# Altium project 电机驱动.PrjPcb
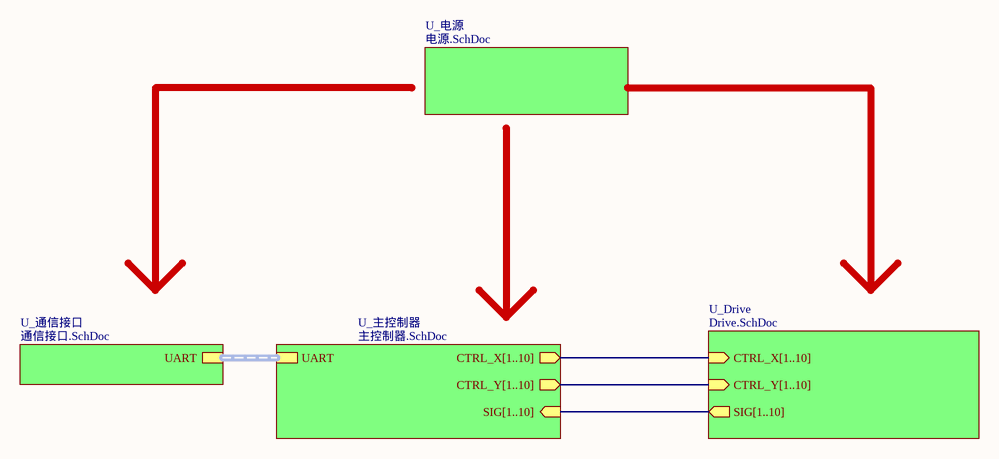
[diagram p0: 顶层设计.SchDoc]
8 sheets, 219 parts. Net scope: hierarchical (ports join the sheet entries above them; power ports are global).
Board file: 货道电机驱动板.PcbDoc
Sheets:
  顶层设计.SchDoc
    U_Drive = Drive.SchDoc
      U_Drive_Y1 = Drive_Y.SchDoc
      U_Drive_Y2 = Drive_Y.SchDoc
      U_Drive_Y3 = Drive_Y.SchDoc
      U_Drive_Y4 = Drive_Y.SchDoc
      U_Drive_Y5 = Drive_Y.SchDoc
      U_Drive_Y6 = Drive_Y.SchDoc
      U_Drive_Y7 = Drive_Y.SchDoc
      U_Drive_Y8 = Drive_Y.SchDoc
      U_Drive_Y9 = Drive_Y.SchDoc
      U_Drive_Y10 = Drive_Y.SchDoc
      U_Drive_X1 = Drive_X.SchDoc
      U_Drive_X2 = Drive_X.SchDoc
      U_Drive_X3 = Drive_X.SchDoc
      U_Drive_X4 = Drive_X.SchDoc
      U_Drive_X5 = Drive_X.SchDoc
      U_Drive_X6 = Drive_X.SchDoc
      U_Drive_X7 = Drive_X.SchDoc
      U_Drive_X8 = Drive_X.SchDoc
      U_Drive_X9 = Drive_X.SchDoc
      U_Drive_X10 = Drive_X.SchDoc
      U_SIG_IN1 = SIG_IN.SchDoc
      U_SIG_IN2 = SIG_IN.SchDoc
      U_SIG_IN3 = SIG_IN.SchDoc
      U_SIG_IN4 = SIG_IN.SchDoc
      U_SIG_IN5 = SIG_IN.SchDoc
      U_SIG_IN6 = SIG_IN.SchDoc
      U_SIG_IN7 = SIG_IN.SchDoc
      U_SIG_IN8 = SIG_IN.SchDoc
      U_SIG_IN9 = SIG_IN.SchDoc
      U_SIG_IN10 = SIG_IN.SchDoc
    U_电源 = 电源.SchDoc
    U_主控制器 = 主控制器.SchDoc
    U_通信接口 = 通信接口.SchDoc

## Sheet 顶层设计.SchDoc
size A4; Organization: Altium Limited; Address1: L3, 12a Rodborough Rd; Address2: Frenchs Forest; Address3: NSW; Address4: Australia 2086

### Sub-sheets
U_Drive = Drive.SchDoc: CTRL_Y[1..10] (in), SIG[1..10] (out), CTRL_X[1..10] (in)
U_主控制器 = 主控制器.SchDoc: CTRL_X[1..10] (out), CTRL_Y[1..10] (out), SIG[1..10] (in), UART (harness USART)
U_电源 = 电源.SchDoc: no entries
U_通信接口 = 通信接口.SchDoc: UART (harness USART)

### Buses and harness runs
bus sheet U_Drive/CTRL_X[1..10] = sheet U_主控制器/CTRL_X[1..10]
bus sheet U_Drive/CTRL_Y[1..10] = sheet U_主控制器/CTRL_Y[1..10]
bus sheet U_Drive/SIG[1..10] = sheet U_主控制器/SIG[1..10]
harness sheet U_主控制器/UART = sheet U_通信接口/UART

### Notes on the sheet
- Title
- Size:
- Date:
- A4
- Number:
- Time:
- Revision:
- Sheet
- of
- File:

## Sheet Drive.SchDoc
size A4; Organization: Altium Limited; Address1: L3, 12a Rodborough Rd; Address2: Frenchs Forest; Address3: NSW; Address4: Australia 2086
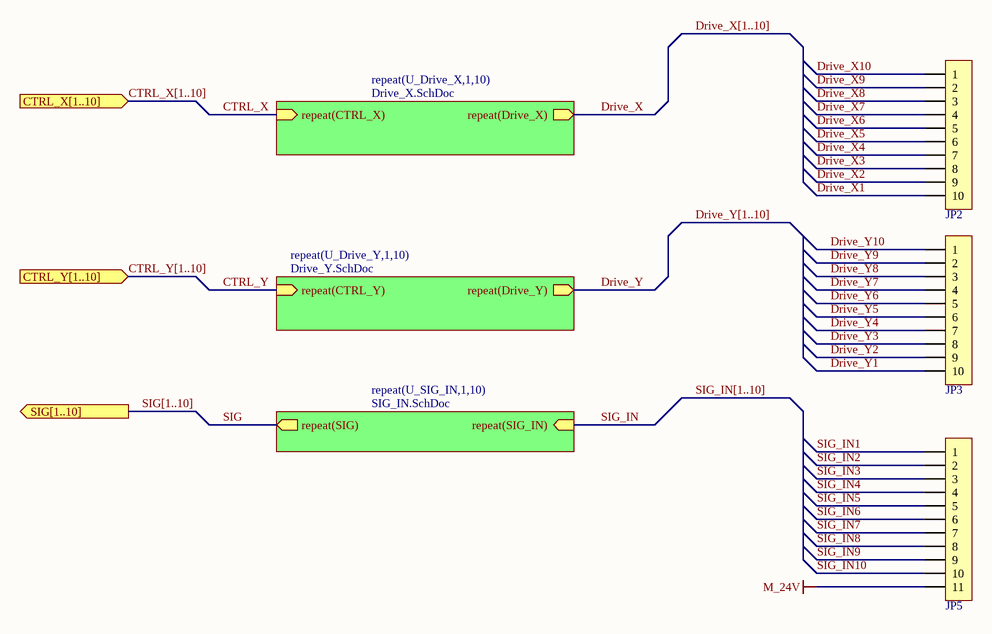
[diagram p1: Drive.SchDoc]

### Parts
JP2  XH2.54-10P  [XH2.54-10P]  (value not drawn)
JP3  XH2.54-10P  [XH2.54-10P]  (value not drawn)
JP5  XH2.54-11P  [XH2.54-11P]  (value not drawn)

### Sub-sheets
repeat(U_Drive_X,1,10) = Drive_X.SchDoc: repeat(CTRL_X) (in), repeat(Drive_X) (out)
repeat(U_Drive_Y,1,10) = Drive_Y.SchDoc: repeat(CTRL_Y) (in), repeat(Drive_Y) (out)
repeat(U_SIG_IN,1,10) = SIG_IN.SchDoc: repeat(SIG) (out), repeat(SIG_IN) (in)

### Ports
CTRL_X[1..10] (in), CTRL_Y[1..10] (in), SIG[1..10] (out)

### Nets
M_24V: JP5.11
CTRL_X: sheet repeat(U_Drive_X,1,10)/repeat(CTRL_X)
CTRL_Y: sheet repeat(U_Drive_Y,1,10)/repeat(CTRL_Y)
Drive_X: sheet repeat(U_Drive_X,1,10)/repeat(Drive_X)
Drive_X1: JP2.10  [project net Drive_X]
Drive_X2: JP2.9  [project net Drive_X]
Drive_X3: JP2.8  [project net Drive_X]
Drive_X4: JP2.7  [project net Drive_X]
Drive_X5: JP2.6  [project net Drive_X]
Drive_X6: JP2.5  [project net Drive_X]
Drive_X7: JP2.4  [project net Drive_X]
Drive_X8: JP2.3  [project net Drive_X]
Drive_X9: JP2.2  [project net Drive_X]
Drive_X10: JP2.1  [project net Drive_X]
Drive_Y: sheet repeat(U_Drive_Y,1,10)/repeat(Drive_Y)
Drive_Y1: JP3.10  [project net Drive_Y]
Drive_Y2: JP3.9  [project net Drive_Y]
Drive_Y3: JP3.8  [project net Drive_Y]
Drive_Y4: JP3.7  [project net Drive_Y]
Drive_Y5: JP3.6  [project net Drive_Y]
Drive_Y6: JP3.5  [project net Drive_Y]
Drive_Y7: JP3.4  [project net Drive_Y]
Drive_Y8: JP3.3  [project net Drive_Y]
Drive_Y9: JP3.2  [project net Drive_Y]
Drive_Y10: JP3.1  [project net Drive_Y]
SIG: sheet repeat(U_SIG_IN,1,10)/repeat(SIG)
SIG_IN: sheet repeat(U_SIG_IN,1,10)/repeat(SIG_IN)
SIG_IN1: JP5.1  [project net SIG_IN]
SIG_IN2: JP5.2  [project net SIG_IN]
SIG_IN3: JP5.3  [project net SIG_IN]
SIG_IN4: JP5.4  [project net SIG_IN]
SIG_IN5: JP5.5  [project net SIG_IN]
SIG_IN6: JP5.6  [project net SIG_IN]
SIG_IN7: JP5.7  [project net SIG_IN]
SIG_IN8: JP5.8  [project net SIG_IN]
SIG_IN9: JP5.9  [project net SIG_IN]
SIG_IN10: JP5.10  [project net SIG_IN]

### Buses and harness runs
bus CTRL_X[1..10] = port CTRL_X[1..10]
bus CTRL_Y[1..10] = port CTRL_Y[1..10]
bus Drive_X[1..10]
bus Drive_Y[1..10]
bus SIG[1..10] = port SIG[1..10]
bus SIG_IN[1..10]

### Notes on the sheet
- Title
- Size:
- Date:
- A4
- Number:
- Time:
- Revision:
- Sheet
- of
- File:

### Library data of the parts
JP2 JP3 = Header 10: 10P接插件; 版权归属: 源创客; BOM名称: 10P接插件; 学习资源: www.ooocke.com
JP5 = Header 11: 11P接插件; 版权归属: 源创客; BOM名称: 11P接插件; 学习资源: www.ooocke.com

## Sheet Drive_Y.SchDoc
size A4; Organization: Altium Limited; Address1: L3, 12a Rodborough Rd; Address2: Frenchs Forest; Address3: NSW; Address4: Australia 2086
Used 10 times, as channels U_Drive/U_Drive_Y1, U_Drive/U_Drive_Y2, U_Drive/U_Drive_Y3, U_Drive/U_Drive_Y4, U_Drive/U_Drive_Y5, U_Drive/U_Drive_Y6, U_Drive/U_Drive_Y7, U_Drive/U_Drive_Y8, U_Drive/U_Drive_Y9, U_Drive/U_Drive_Y10. Parts and nets are listed once, with the designators drawn on the sheet.
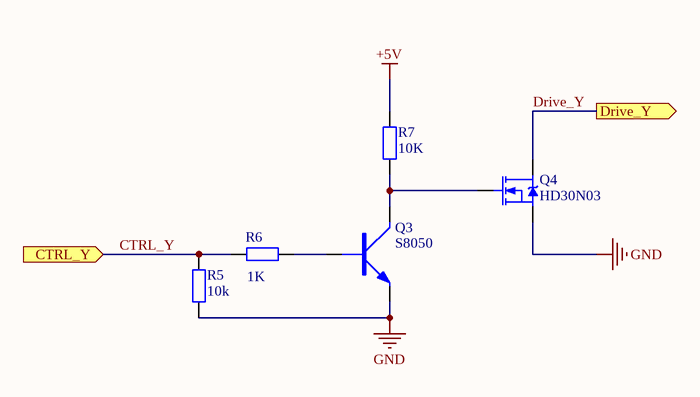
[diagram p2: Drive_Y.SchDoc]

### Parts
Q3  S8050  [SOT-23]
Q4  HD30N03  [TO252]
R5  10k  [R 0603]
R6  1K  [R 0603]
R7  10K  [R 0603]

### Ports
CTRL_Y (in), Drive_Y (out)

### Nets
+5V: R7.2
GND: Q3.E Q4.S R5.1
CTRL_Y: R5.2 R6.1 ; port CTRL_Y
Drive_Y: Q4.D ; port Drive_Y
NetQ3_B: Q3.B R6.2
NetQ3_C: Q3.C Q4.G R7.1

### Channels
U_Drive/U_Drive_Y1: designators end in _U_Drive_Y1; ports CTRL_Y=CTRL_Y Drive_Y=Drive_Y
U_Drive/U_Drive_Y2: designators end in _U_Drive_Y2; ports CTRL_Y=CTRL_Y Drive_Y=Drive_Y
U_Drive/U_Drive_Y3: designators end in _U_Drive_Y3; ports CTRL_Y=CTRL_Y Drive_Y=Drive_Y
U_Drive/U_Drive_Y4: designators end in _U_Drive_Y4; ports CTRL_Y=CTRL_Y Drive_Y=Drive_Y
U_Drive/U_Drive_Y5: designators end in _U_Drive_Y5; ports CTRL_Y=CTRL_Y Drive_Y=Drive_Y
U_Drive/U_Drive_Y6: designators end in _U_Drive_Y6; ports CTRL_Y=CTRL_Y Drive_Y=Drive_Y
U_Drive/U_Drive_Y7: designators end in _U_Drive_Y7; ports CTRL_Y=CTRL_Y Drive_Y=Drive_Y
U_Drive/U_Drive_Y8: designators end in _U_Drive_Y8; ports CTRL_Y=CTRL_Y Drive_Y=Drive_Y
U_Drive/U_Drive_Y9: designators end in _U_Drive_Y9; ports CTRL_Y=CTRL_Y Drive_Y=Drive_Y
U_Drive/U_Drive_Y10: designators end in _U_Drive_Y10; ports CTRL_Y=CTRL_Y Drive_Y=Drive_Y

### Notes on the sheet
- Title
- Size:
- Date:
- A4
- Number:
- Time:
- Revision:
- Sheet
- of
- File:

### Library data of the parts
Q3 = NPN: NPN三极管
Q4 = N-MOS: N沟道场效应管
R5-R7 = R: 贴片电阻; 版权归属: 源创客; BOM名称: 贴片电阻; 学习资源: www.ooocke.com

## Sheet Drive_X.SchDoc
size A4; Organization: Altium Limited; Address1: L3, 12a Rodborough Rd; Address2: Frenchs Forest; Address3: NSW; Address4: Australia 2086
Used 10 times, as channels U_Drive/U_Drive_X1, U_Drive/U_Drive_X2, U_Drive/U_Drive_X3, U_Drive/U_Drive_X4, U_Drive/U_Drive_X5, U_Drive/U_Drive_X6, U_Drive/U_Drive_X7, U_Drive/U_Drive_X8, U_Drive/U_Drive_X9, U_Drive/U_Drive_X10. Parts and nets are listed once, with the designators drawn on the sheet.
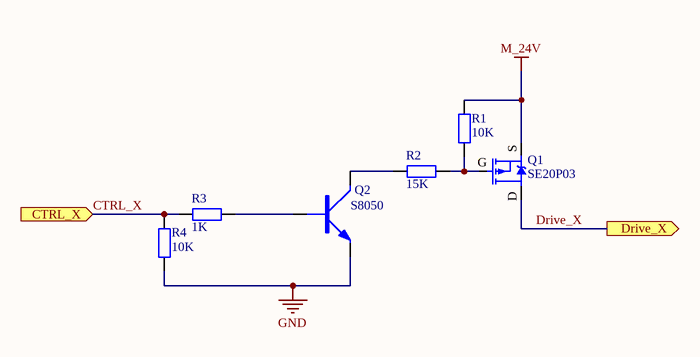
[diagram p3: Drive_X.SchDoc]

### Parts
Q1  SE20P03  [TO252]
Q2  S8050  [SOT-23]
R1  10K  [R 0603]
R2  15K  [R 0603]
R3  1K  [R 0603]
R4  10K  [R 0603]

### Ports
CTRL_X (in), Drive_X (out)

### Nets
GND: Q2.E R4.2
M_24V: Q1.S R1.2
CTRL_X: R3.1 R4.1 ; port CTRL_X
Drive_X: Q1.D ; port Drive_X
NetQ1_G: Q1.G R1.1 R2.1
NetQ2_B: Q2.B R3.2
NetQ2_C: Q2.C R2.2

### Channels
U_Drive/U_Drive_X1: designators end in _U_Drive_X1; ports CTRL_X=CTRL_X Drive_X=Drive_X
U_Drive/U_Drive_X2: designators end in _U_Drive_X2; ports CTRL_X=CTRL_X Drive_X=Drive_X
U_Drive/U_Drive_X3: designators end in _U_Drive_X3; ports CTRL_X=CTRL_X Drive_X=Drive_X
U_Drive/U_Drive_X4: designators end in _U_Drive_X4; ports CTRL_X=CTRL_X Drive_X=Drive_X
U_Drive/U_Drive_X5: designators end in _U_Drive_X5; ports CTRL_X=CTRL_X Drive_X=Drive_X
U_Drive/U_Drive_X6: designators end in _U_Drive_X6; ports CTRL_X=CTRL_X Drive_X=Drive_X
U_Drive/U_Drive_X7: designators end in _U_Drive_X7; ports CTRL_X=CTRL_X Drive_X=Drive_X
U_Drive/U_Drive_X8: designators end in _U_Drive_X8; ports CTRL_X=CTRL_X Drive_X=Drive_X
U_Drive/U_Drive_X9: designators end in _U_Drive_X9; ports CTRL_X=CTRL_X Drive_X=Drive_X
U_Drive/U_Drive_X10: designators end in _U_Drive_X10; ports CTRL_X=CTRL_X Drive_X=Drive_X

### Notes on the sheet
- Title
- Size:
- Date:
- A4
- Number:
- Time:
- Revision:
- Sheet
- of
- File:

### Library data of the parts
Q1 = P-MOS: P沟道场效应管
Q2 = NPN: NPN三极管
R1-R4 = R: 贴片电阻; 版权归属: 源创客; BOM名称: 贴片电阻; 学习资源: www.ooocke.com

## Sheet SIG_IN.SchDoc
size A4; Organization: Altium Limited; Address1: L3, 12a Rodborough Rd; Address2: Frenchs Forest; Address3: NSW; Address4: Australia 2086
Used 10 times, as channels U_Drive/U_SIG_IN1, U_Drive/U_SIG_IN2, U_Drive/U_SIG_IN3, U_Drive/U_SIG_IN4, U_Drive/U_SIG_IN5, U_Drive/U_SIG_IN6, U_Drive/U_SIG_IN7, U_Drive/U_SIG_IN8, U_Drive/U_SIG_IN9, U_Drive/U_SIG_IN10. Parts and nets are listed once, with the designators drawn on the sheet.
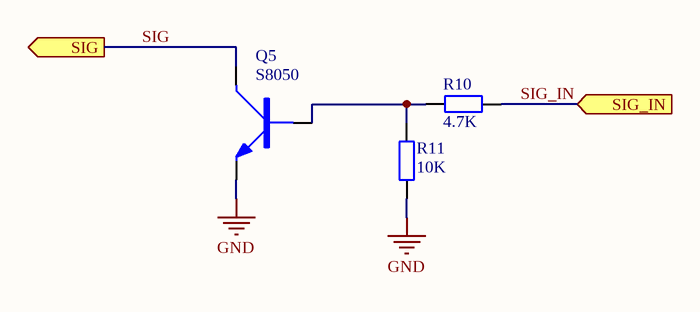
[diagram p4: SIG_IN.SchDoc]

### Parts
Q5  S8050  [SOT-23]
R10  4.7K  [R 0603]
R11  10K  [R 0603]

### Ports
SIG (out), SIG_IN (in)

### Nets
GND: Q5.E R11.1
SIG: Q5.C ; port SIG
SIG_IN: R10.2 ; port SIG_IN
NetQ5_B: Q5.B R10.1 R11.2

### Channels
U_Drive/U_SIG_IN1: designators end in _U_SIG_IN1; ports SIG=SIG SIG_IN=SIG_IN
U_Drive/U_SIG_IN2: designators end in _U_SIG_IN2; ports SIG=SIG SIG_IN=SIG_IN
U_Drive/U_SIG_IN3: designators end in _U_SIG_IN3; ports SIG=SIG SIG_IN=SIG_IN
U_Drive/U_SIG_IN4: designators end in _U_SIG_IN4; ports SIG=SIG SIG_IN=SIG_IN
U_Drive/U_SIG_IN5: designators end in _U_SIG_IN5; ports SIG=SIG SIG_IN=SIG_IN
U_Drive/U_SIG_IN6: designators end in _U_SIG_IN6; ports SIG=SIG SIG_IN=SIG_IN
U_Drive/U_SIG_IN7: designators end in _U_SIG_IN7; ports SIG=SIG SIG_IN=SIG_IN
U_Drive/U_SIG_IN8: designators end in _U_SIG_IN8; ports SIG=SIG SIG_IN=SIG_IN
U_Drive/U_SIG_IN9: designators end in _U_SIG_IN9; ports SIG=SIG SIG_IN=SIG_IN
U_Drive/U_SIG_IN10: designators end in _U_SIG_IN10; ports SIG=SIG SIG_IN=SIG_IN

### Notes on the sheet
- Title
- Size:
- Date:
- A4
- Number:
- Time:
- Revision:
- Sheet
- of
- File:

### Library data of the parts
Q5 = NPN: NPN三极管
R10 R11 = R: 贴片电阻; 版权归属: 源创客; BOM名称: 贴片电阻; 学习资源: www.ooocke.com

## Sheet 电源.SchDoc
size A4; Organization: Altium Limited; Address1: L3, 12a Rodborough Rd; Address2: Frenchs Forest; Address3: NSW; Address4: Australia 2086
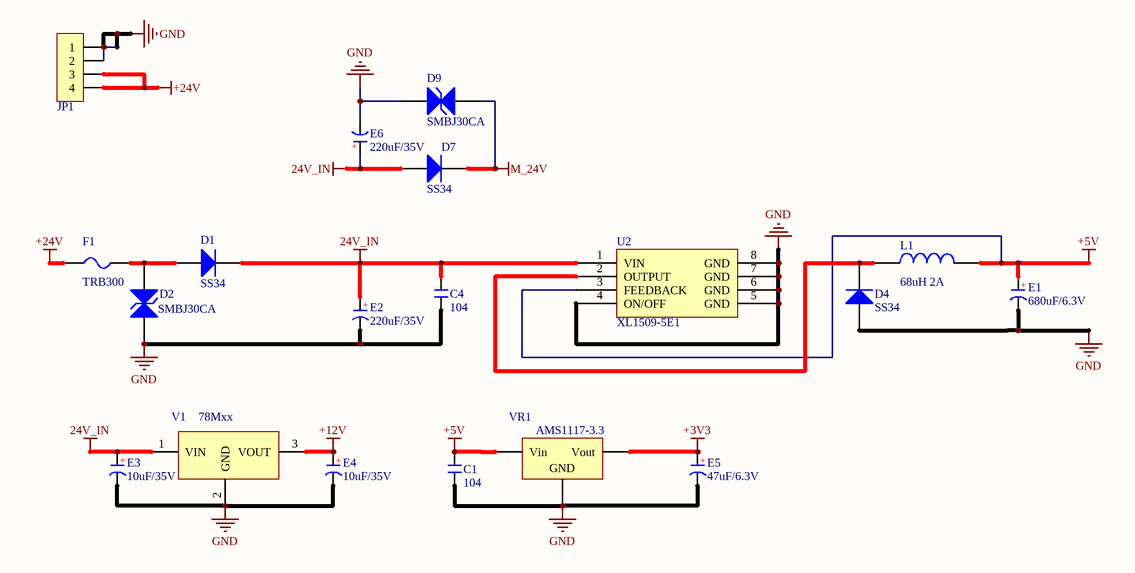
[diagram p5: 电源.SchDoc]

### Parts
C1  104  [C 0603]
C4  104  [C 0603]
D1  SS34  [SMA(DO-214AC)_S1]
D2  SMBJ30CA  [LC-SMA(DO-214AC)_S1]
D4  SS34  [SMA(DO-214AC)_S1]
D7  SS34  [SMA(DO-214AC)_S1]
D9  SMBJ30CA  [LC-SMA(DO-214AC)_S1]
E1  680uF/6.3V  [CM E(8*10.2)]
E2  220uF/35V  [CM E(8*10.2)]
E3  10uF/35V  [CM B(4*5.4)]
E4  10uF/35V  [CM B(4*5.4)]
E5  47uF/6.3V  [CM C(5*5.4)]
E6  220uF/35V  [CM E(8*10.2)]
F1  TRB300  [5.08mm]
JP1  XH-2.54-4P  [XH2.54-4P]  (value not drawn)
L1  68uH 2A  [CDRH74]
U2  XL1509-5E1  [SOP-8_150mil]
V1  78Mxx  [LC-TO-252-2]
VR1  AMS1117-3.3  [SOT-223]

### Nets
24V_IN: C4.2 D1.2(K) D7.1(A) E2.1(A) E3.1(A) E6.1(A) U2.1(VIN) V1.1(VIN)
+3V3: E5.1(A) VR1.2(Vout)
+5V: C1.2 E1.1(A) L1.2 U2.3(FEEDBACK) VR1.3(Vin)
+12V: E4.1(A) V1.3(VOUT)
+24V: F1.1 JP1.3 JP1.4
GND: C1.1 C4.1 D2.1(A) D4.1(A) D9.1(A) E1.2(K) E2.2(K) E3.2(K) E4.2(K) E5.2(K) E6.2(K) JP1.1 JP1.2 U2.4(ON/OFF) U2.5(GND) U2.6(GND) U2.7(GND) U2.8(GND) V1.2(GND) VR1.1(GND)
M_24V: D7.2(K) D9.2(K)
NetD1_1: D1.1(A) D2.2(K) F1.2
NetD4_2: D4.2(K) L1.1 U2.2(OUTPUT)

### Notes on the sheet
- Title
- Size:
- Date:
- A4
- Number:
- Time:
- Revision:
- Sheet
- of
- File:
- (in symbol C-CM) +

### Library data of the parts
C1 C4 = C: 无极性贴片电容; 版权归属: 源创客; BOM名称: 无极性贴片电容; 学习资源: www.ooocke.com
D1 D4 D7 = SMA(DO-214AC) SS54: 二极管; ComponentLink1Description: 供应商链接; ComponentLink1URL: http://www.szlcsc.com/product/details_23178.html; Package: SMA(DO-214AC); Supplier: LC; SuppliersPartNumber: C22452
D2 D9 = SMB/DO-214AA P6SMB6.8CA: TVS; ComponentLink1Description: 供应商链接; ComponentLink1URL: http://www.szlcsc.com/product/details_79530.html; Package: SMB/DO-214AA; Supplier: LC; SuppliersPartNumber: C78395
E1-E6 = C-CM: 贴片电解电容; 版权归属: 源创客; BOM名称: 贴片电解电容; 学习资源: www.ooocke.com
F1 = FU: 直插保险丝; BOM名称: 贴片保险丝; 版权归属: 源创客; 学习资源: www.ooocke.com
JP1 = Header 4: 4P接插件; 版权归属: 源创客; BOM名称: 4P接插件; 学习资源: www.ooocke.com
L1 = INDUCTOR
U2 = XL1509-3.3E1: DC-DC芯片; ComponentLink1Description: 供应商链接; ComponentLink1URL: http://www.szlcsc.com/product/details_62115.html; Package: SOP-8_150mil; Supplier: LC; SuppliersPartNumber: C61063
V1 = 78Mxx: 线性稳压芯片; 版权归属: 源创客; BOM名称: 线性稳压芯片; 学习资源: www.ooocke.com
VR1 = SOT-223 AMS1117-3.3: 低压差线性稳压(LDO); ComponentLink1Description: 供应商链接; ComponentLink1URL: http://www.szlcsc.com/product/details_6652.html; Package: SOT-223; Supplier: LC; SuppliersPartNumber: C6186

## Sheet 主控制器.SchDoc
size A3; Organization: Altium Limited; Address1: L3, 12a Rodborough Rd; Address2: Frenchs Forest; Address3: NSW; Address4: Australia 2086
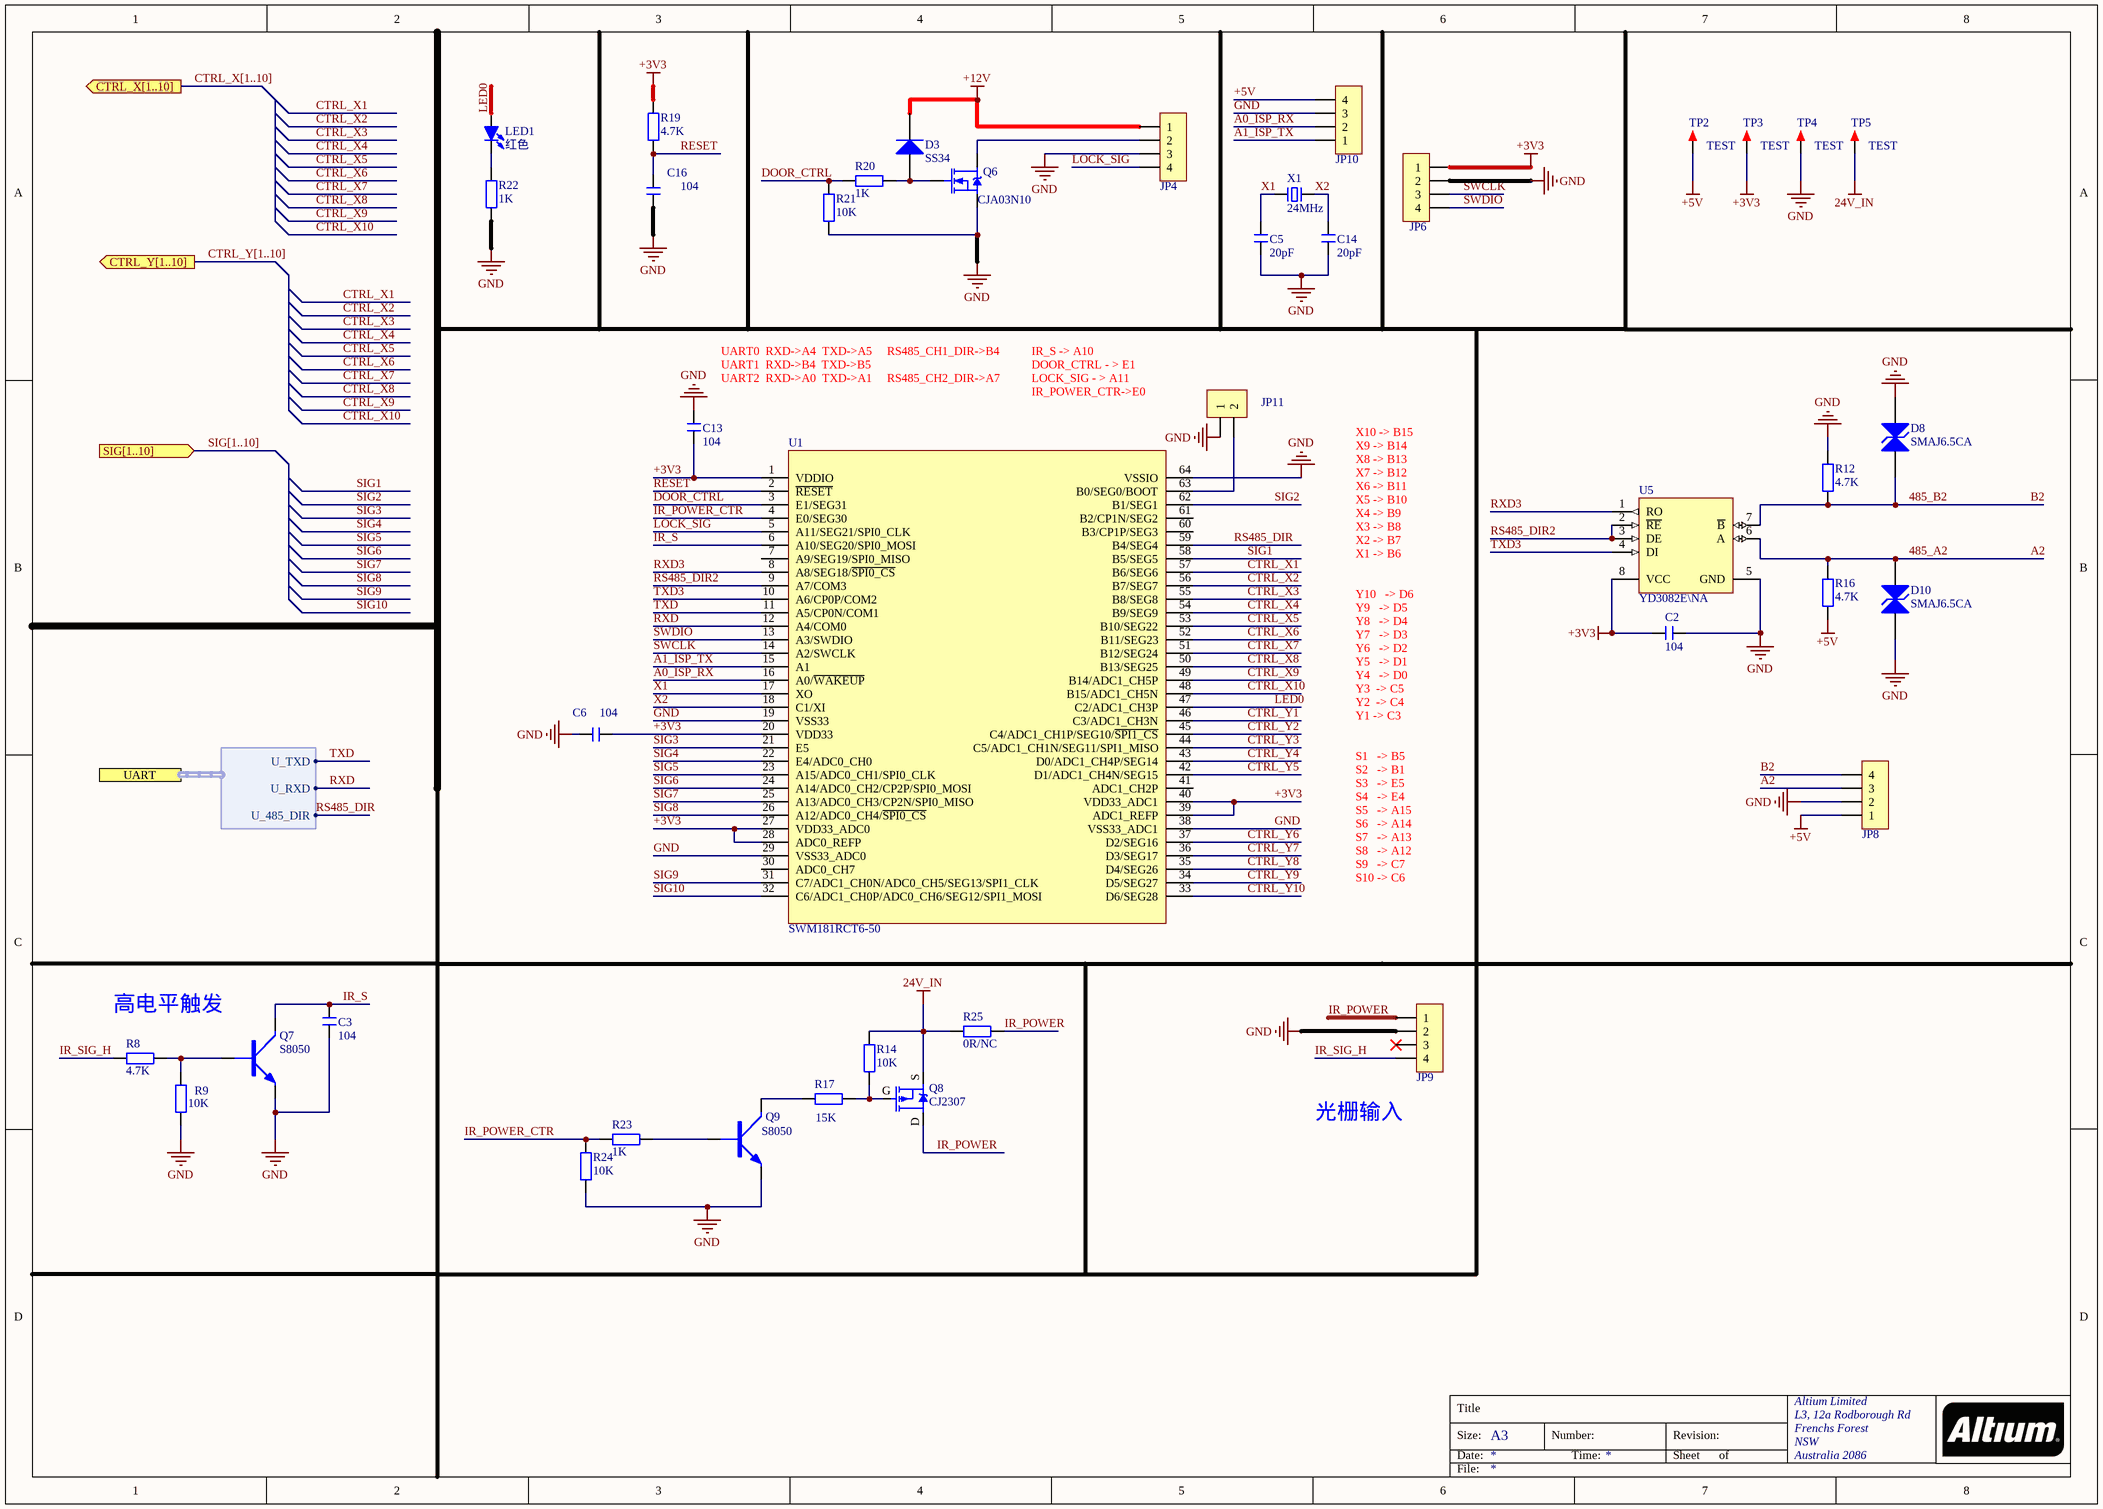
[diagram p6: 主控制器.SchDoc]

### Parts
C2  104  [C 0603]
C3  104  [C 0603]
C5  20pF  [C 0603]
C6  104  [C 0603]
C13  104  [C 0603]
C14  20pF  [C 0603]
C16  104  [C 0603]
D3  SS34  [SMA(DO-214AC)_S1]
D8  SMAJ6.5CA  [SMA(DO-214AC)_S1]
D10  SMAJ6.5CA  [SMA(DO-214AC)_S1]
JP4  XH-2.54-4P  [XH2.54-4P]  (value not drawn)
JP6  HDR-1X4  [HDR-1X4]  (value not drawn)
JP8  XH-2.54-4P  [XH2.54-4P]  (value not drawn)
JP9  HDR-1X4  [XH2.54-4P]  (value not drawn)
JP10  XH-2.54-4P  [XH2.54-4P]  (value not drawn)
JP11  HDR-1X2  [HDR-1X2]  (value not drawn)
LED1  红色  [LED 0603G]
Q6  CJA03N10  [LC-SOT-89(SOT-89-3)]
Q7  S8050  [SOT-23]
Q8  CJ2307  [SOT23]
Q9  S8050  [SOT-23]
R8  4.7K  [R 0603]
R9  10K  [R 0603]
R12  4.7K  [R 0603]
R14  10K  [R 0603]
R16  4.7K  [R 0603]
R17  15K  [R 0603]
R19  4.7K  [R 0603]
R20  1K  [R 0603]
R21  10K  [R 0603]
R22  1K  [R 0603]
R23  1K  [R 0603]
R24  10K  [R 0603]
R25  0R/NC  [R 0603]
TP2  TEST  [TEST 1]
TP3  TEST  [TEST 1]
TP4  TEST  [TEST 1]
TP5  TEST  [TEST 1]
U1  SWM181RCT6-50  [LC-LQFP-64_10x10x05P]
U5  YD3082E\NA  [SOIC-8_150mil]
X1  24MHz  [XTAL-49S SMD]

### Ports
CTRL_X[1..10] (out), CTRL_Y[1..10] (out), SIG[1..10] (in), UART (harness USART)

### Harnesses
USART: U_TXD, U_RXD, U_485_DIR

### Nets
24V_IN: Q8.S R14.2 R25.2 TP5.1
+3V3: C2.1 C6.2 C13.2 JP6.1 R19.2 TP3.1 U1.1(VDDIO) U1.20(VDD33) U1.27(VDD33_ADC0) U1.28(ADC0_REFP) U1.39(ADC1_REFP) U1.40(VDD33_ADC1) U5.8(VCC)
+5V: JP8.1 JP10.4 R16.1 TP2.1
+12V: D3.2(K) JP4.1
GND: C2.2 C3.1 C5.1 C6.1 C13.1 C14.1 C16.2 D8.1(A) D10.1(A) JP4.3 JP6.2 JP8.2 JP9.2 JP10.3 JP11.1 Q6.3(S) Q7.E Q9.E R9.1 R12.2 R21.2 R22.1 R24.2 TP4.1 U1.19(VSS33) U1.29(VSS33_ADC0) U1.38(VSS33_ADC1) U1.64(VSSIO) U5.5(GND)
485_A2: D10.2(K) JP8.3 R16.2 U5.6(A)  [also labelled A2]
485_B2: D8.2(K) JP8.4 R12.1 U5.7(~{B})  [also labelled B2]
A0_ISP_RX: JP10.2 U1.16(A0/~{WAKEUP})
A1_ISP_TX: JP10.1 U1.15(A1)
CTRL_X1: U1.57(B6/SEG6)  [project net CTRL_X]
CTRL_X2: U1.56(B7/SEG7)  [project net CTRL_X]
CTRL_X3: U1.55(B8/SEG8)  [project net CTRL_X]
CTRL_X4: U1.54(B9/SEG9)  [project net CTRL_X]
CTRL_X5: U1.53(B10/SEG22)  [project net CTRL_X]
CTRL_X6: U1.52(B11/SEG23)  [project net CTRL_X]
CTRL_X7: U1.51(B12/SEG24)  [project net CTRL_X]
CTRL_X8: U1.50(B13/SEG25)  [project net CTRL_X]
CTRL_X9: U1.49(B14/ADC1_CH5P)  [project net CTRL_X]
CTRL_X10: U1.48(B15/ADC1_CH5N)  [project net CTRL_X]
CTRL_Y1: U1.46(C3/ADC1_CH3N)  [project net CTRL_Y]
CTRL_Y2: U1.45(C4/ADC1_CH1P/SEG10/~{SPI1_CS})  [project net CTRL_Y]
CTRL_Y3: U1.44(C5/ADC1_CH1N/SEG11/SPI1_MISO)  [project net CTRL_Y]
CTRL_Y4: U1.43(D0/ADC1_CH4P/SEG14)  [project net CTRL_Y]
CTRL_Y5: U1.42(D1/ADC1_CH4N/SEG15)  [project net CTRL_Y]
CTRL_Y6: U1.37(D2/SEG16)  [project net CTRL_Y]
CTRL_Y7: U1.36(D3/SEG17)  [project net CTRL_Y]
CTRL_Y8: U1.35(D4/SEG26)  [project net CTRL_Y]
CTRL_Y9: U1.34(D5/SEG27)  [project net CTRL_Y]
CTRL_Y10: U1.33(D6/SEG28)  [project net CTRL_Y]
DOOR_CTRL: R20.1 R21.1 U1.3(E1/SEG31)
IR_POWER: JP9.1 Q8.D R25.1
IR_POWER_CTR: R23.1 R24.1 U1.4(E0/SEG30)
IR_S: C3.2 Q7.C U1.6(A10/SEG20/SPI0_MOSI)
IR_SIG_H: JP9.4 R8.2
LED0: LED1.1(A) U1.47(C2/ADC1_CH3P)
LOCK_SIG: JP4.4 U1.5(A11/SEG21/SPI0_CLK)
RESET: C16.1 R19.1 U1.2(~{RESET})
RS485_DIR: U1.59(B4/SEG4) ; port UART.U_485_DIR
RS485_DIR2: U1.9(A7/COM3) U5.2(~{RE}) U5.3(DE)
RXD: U1.12(A4/COM0) ; port UART.U_RXD
RXD3: U1.8(A8/SEG18/~{SPI0_CS}) U5.1(RO)
SIG1: U1.58(B5/SEG5)  [project net SIG]
SIG2: U1.62(B1/SEG1)  [project net SIG]
SIG3: U1.21(E5)  [project net SIG]
SIG4: U1.22(E4/ADC0_CH0)  [project net SIG]
SIG5: U1.23(A15/ADC0_CH1/SPI0_CLK)  [project net SIG]
SIG6: U1.24(A14/ADC0_CH2/CP2P/SPI0_MOSI)  [project net SIG]
SIG7: U1.25(A13/ADC0_CH3/CP2N/SPI0_MISO)  [project net SIG]
SIG8: U1.26(A12/ADC0_CH4/~{SPI0_CS})  [project net SIG]
SIG9: U1.31(C7/ADC1_CH0N/ADC0_CH5/SEG13/SPI1_CLK)  [project net SIG]
SIG10: U1.32(C6/ADC1_CH0P/ADC0_CH6/SEG12/SPI1_MOSI)  [project net SIG]
SWCLK: JP6.3 U1.14(A2/SWCLK)
SWDIO: JP6.4 U1.13(A3/SWDIO)
TXD: U1.11(A5/CP0N/COM1) ; port UART.U_TXD
TXD3: U1.10(A6/CP0P/COM2) U5.4(DI)
X1: C5.2 U1.17(XO) X1.1
X2: C14.2 U1.18(C1/XI) X1.2
NetD3_1: D3.1(A) Q6.1(G) R20.2
NetJP4_2: JP4.2 Q6.2(D)
NetJP11_2: JP11.2 U1.63(B0/SEG0/BOOT)
NetLED1_2: LED1.2(K) R22.2
NetQ7_B: Q7.B R8.1 R9.2
NetQ8_G: Q8.G R14.1 R17.1
NetQ9_B: Q9.B R23.2
NetQ9_C: Q9.C R17.2

Not connected (* = marked no-connect by the designer): JP9 3*; U1 7(A9/SEG19/SPI0_MISO) 30(ADC0_CH7) 41(ADC1_CH2P) 60(B3/CP1P/SEG3) 61(B2/CP1N/SEG2)

### Buses and harness runs
bus CTRL_X[1..10] = port CTRL_X[1..10]
bus CTRL_Y[1..10] = port CTRL_Y[1..10]
bus SIG[1..10] = port SIG[1..10]

### Notes on the sheet
- (near C13) UART0  RXD->A4  TXD->A5     RS485_CH1_DIR->B4
  UART1  RXD->B4  TXD->B5
  UART2  RXD->A0  TXD->A1     RS485_CH2_DIR->A7
- IR_S -> A10
  DOOR_CTRL - > E1
  LOCK_SIG - > A11
  IR_POWER_CTR->E0
- X10 -> B15
  X9 -> B14
  X8 -> B13
  X7 -> B12
  X6 -> B11
  X5 -> B10
  X4 -> B9
  X3 -> B8
  X2 -> B7
  X1 -> B6
- Y10   -> D6
  Y9   -> D5
  Y8   -> D4
  Y7   -> D3
  Y6   -> D2
  Y5   -> D1
  Y4   -> D0
  Y3  -> C5
  Y2  -> C4
  Y1 -> C3
- S1   -> B5
  S2   -> B1
  S3   -> E5
  S4   -> E4
  S5   -> A15
  S6   -> A14
  S7   -> A13
  S8   -> A12
  S9   -> C7
  S10 -> C6
- (near R8) 高电平触发
- 光栅输入
- Title
- Size:
- Date:
- A3
- Number:
- Time:
- Revision:
- Sheet
- of
- File:

### Library data of the parts
C2 C3 C5 C6 C13 C14 C16 = C: 无极性贴片电容; 版权归属: 源创客; BOM名称: 无极性贴片电容; 学习资源: www.ooocke.com
D3 = SMA(DO-214AC) SS54: 二极管; ComponentLink1Description: 供应商链接; ComponentLink1URL: http://www.szlcsc.com/product/details_23178.html; Package: SMA(DO-214AC); Supplier: LC; SuppliersPartNumber: C22452
D8 D10 = SMB/DO-214AA P6SMB6.8CA: TVS; ComponentLink1Description: 供应商链接; ComponentLink1URL: http://www.szlcsc.com/product/details_79530.html; Package: SMB/DO-214AA; Supplier: LC; SuppliersPartNumber: C78395
JP4 JP6 JP8-JP10 = Header 4: 4P接插件; 版权归属: 源创客; BOM名称: 4P接插件; 学习资源: www.ooocke.com
JP11 = Header 2: 2P接插件; 版权归属: 源创客; BOM名称: 2P接插件; 学习资源: www.ooocke.com
LED1 = LED-SMD: 贴片LED; 版权归属: 源创客; BOM名称: 贴片LED; 学习资源: www.ooocke.com
Q6 = CJA03N10: N沟道场效应管
Q7 Q9 = NPN: NPN三极管
Q8 = P-MOS: P沟道场效应管
R8 R9 R12 R14 R16 R17 R19-R25 = R: 贴片电阻; 版权归属: 源创客; BOM名称: 贴片电阻; 学习资源: www.ooocke.com
TP2-TP5 = TEST: 测试点; 版权归属: 源创客; BOM名称: 测试点; 学习资源: www.ooocke.com
U1 = SWM181RCT6-50: 微控制器, Cortex-M0系列, AA-00
U5 = SP485EEN-L/TR: RS-485/RS-422; ComponentLink1Description: 供应商链接; ComponentLink1URL: http://www.szlcsc.com/product/details_7327.html; Package: SOIC-8; Supplier: LC; SuppliersPartNumber: C6855
X1 = XTAL-2: 2脚晶振; 版权归属: 源创客; BOM名称: 2脚晶振; 学习资源: www.ooocke.com

## Sheet 通信接口.SchDoc
size A4; Organization: Altium Limited; Address1: L3, 12a Rodborough Rd; Address2: Frenchs Forest; Address3: NSW; Address4: Australia 2086
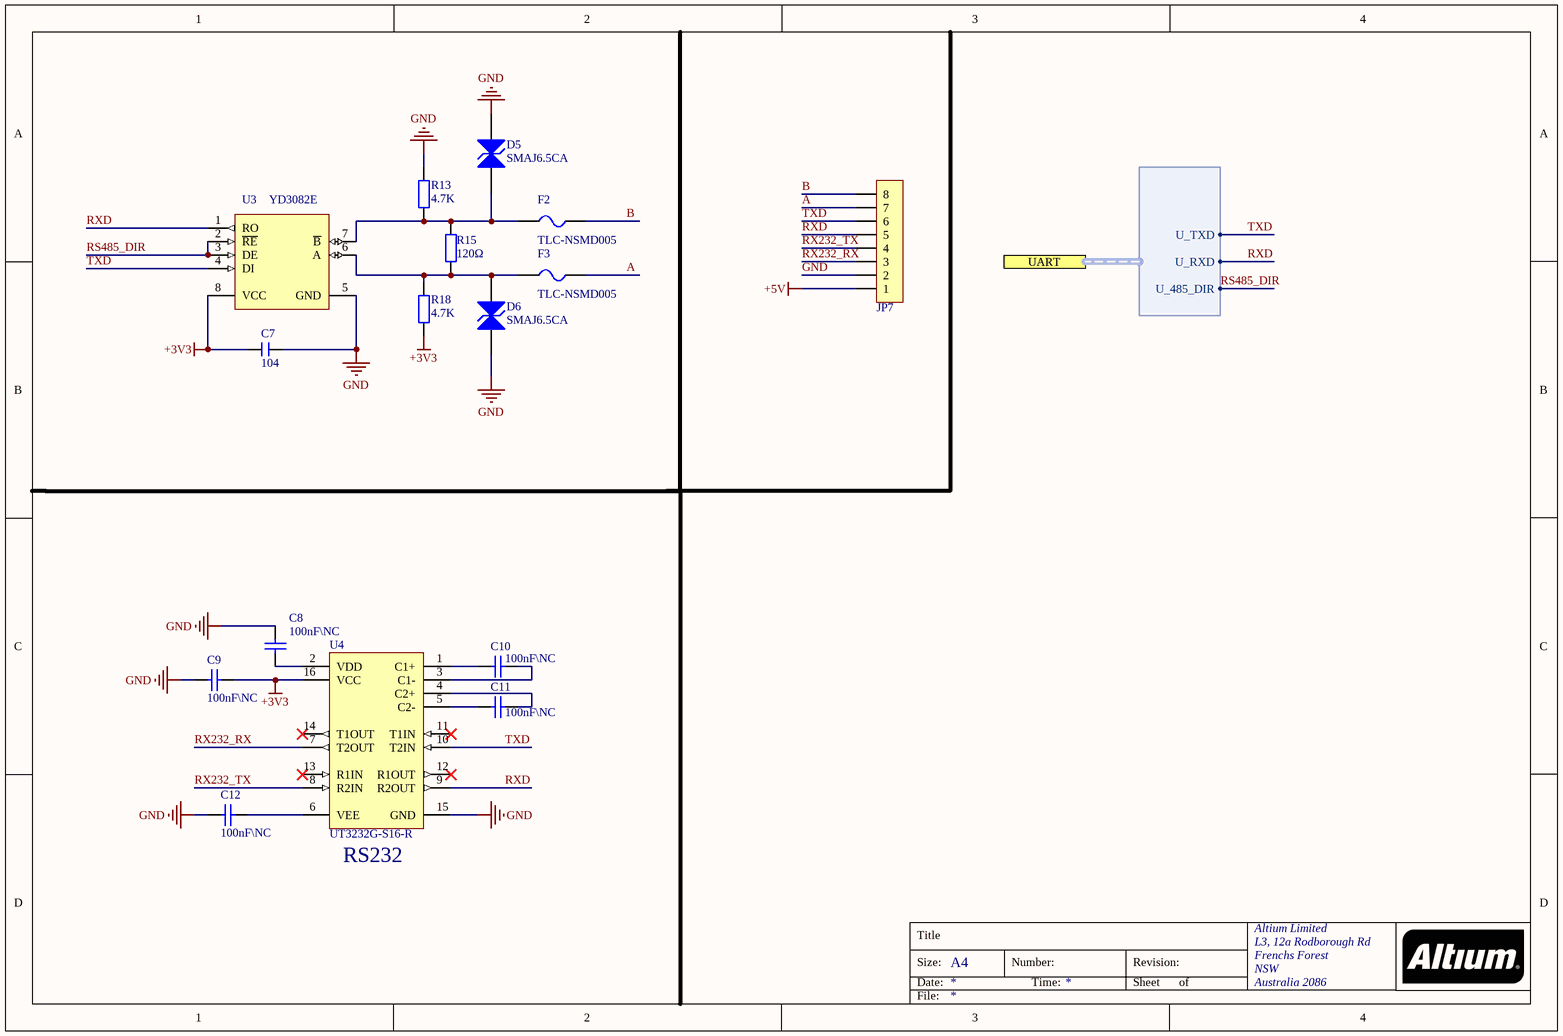
[diagram p7: 通信接口.SchDoc]

### Parts
C7  104  [C 0603]
C8  100nF\NC  [0603_C]
C9  100nF\NC  [0603_C]
C10  100nF\NC  [0603_C]
C11  100nF\NC  [0603_C]
C12  100nF\NC  [0603_C]
D5  SMAJ6.5CA  [SMA(DO-214AC)_S1]
D6  SMAJ6.5CA  [SMA(DO-214AC)_S1]
F2  TLC-NSMD005  [FU 1206]
F3  TLC-NSMD005  [FU 1206]
JP7  XH-2.54-8P  [XH2.54-8P]  (value not drawn)
R13  4.7K  [R 0603]
R15  120Ω  [0603_R]
R18  4.7K  [R 0603]
U3  YD3082E  [SOIC-8_150mil]
U4  UT3232G-S16-R  [SOIC-16_150mil]

### Ports
UART (harness USART)

### Harnesses
USART: U_TXD, U_RXD, U_485_DIR

### Nets
+3V3: C7.1 C9.2 R18.1 U3.8(VCC) U4.16(VCC)
+5V: JP7.1
GND: C7.2 C8.2 C9.1 C12.1 D5.1(A) D6.1(A) JP7.2 R13.2 U3.5(GND) U4.15(GND)
A: F3.2 JP7.7
B: F2.2 JP7.8
RS485_DIR: U3.2(~{RE}) U3.3(DE) ; port UART.U_485_DIR
RX232_RX: JP7.3 U4.7(T2OUT)
RX232_TX: JP7.4 U4.8(R2IN)
RXD: JP7.5 U3.1(RO) U4.9(R2OUT) ; port UART.U_RXD
TXD: JP7.6 U3.4(DI) U4.10(T2IN) ; port UART.U_TXD
NetC8_1: C8.1 U4.2(VDD)
NetC10_1: C10.1 U4.1(C1+)
NetC10_2: C10.2 U4.3(C1-)
NetC11_1: C11.1 U4.5(C2-)
NetC11_2: C11.2 U4.4(C2+)
NetC12_2: C12.2 U4.6(VEE)
NetD5_2: D5.2(K) F2.1 R13.1 R15.1 U3.7(~{B})
NetD6_2: D6.2(K) F3.1 R15.2 R18.2 U3.6(A)

Not connected (* = marked no-connect by the designer): U4 11(T1IN)* 12(R1OUT)* 13(R1IN)* 14(T1OUT)*

### Notes on the sheet
- (near U4) RS232
- Title
- Size:
- Date:
- A4
- Number:
- Time:
- Revision:
- Sheet
- of
- File:

### Library data of the parts
C7 = C: 无极性贴片电容; 版权归属: 源创客; BOM名称: 无极性贴片电容; 学习资源: www.ooocke.com
C8-C12 = 0603 100nF (104) 10% 50V: 贴片电容; ComponentLink1Description: 供应商链接; ComponentLink1URL: http://www.szlcsc.com/product/details_15331.html; Package: 0603; Supplier: LC; SuppliersPartNumber: C14663
D5 D6 = SMB/DO-214AA P6SMB6.8CA: TVS; ComponentLink1Description: 供应商链接; ComponentLink1URL: http://www.szlcsc.com/product/details_79530.html; Package: SMB/DO-214AA; Supplier: LC; SuppliersPartNumber: C78395
F2 F3 = FU: 贴片保险丝; 版权归属: 源创客; BOM名称: 贴片保险丝; 学习资源: www.ooocke.com
JP7 = Header 8: 8P接插件; 版权归属: 源创客; BOM名称: 8P接插件; 学习资源: www.ooocke.com
R13 R18 = R: 贴片电阻; 版权归属: 源创客; BOM名称: 贴片电阻; 学习资源: www.ooocke.com
R15 = 0603 120Ω (1200) 1%: 贴片电阻; ComponentLink1Description: 供应商链接; ComponentLink1URL: http://www.szlcsc.com/product/details_23514.html; Package: 0603; Supplier: LC; SuppliersPartNumber: C22787
U3 = SP485EEN-L/TR: RS-485/RS-422; ComponentLink1Description: 供应商链接; ComponentLink1URL: http://www.szlcsc.com/product/details_7327.html; Package: SOIC-8; Supplier: LC; SuppliersPartNumber: C6855
U4 = MAX232ESE: RS232; ComponentLink1Description: 供应商链接; ComponentLink1URL: http://www.szlcsc.com/product/details_27608.html; Package: SOIC-16_150mil; Supplier: LC; SuppliersPartNumber: C26860

## Nets that join several sheets
24V_IN: 电源 (8 pins), 主控制器 (Q8.S R14.2 R25.2 TP5.1)
+3V3: 电源 (E5.1 VR1.2), 主控制器 (13 pins), 通信接口 (5 pins)
+5V: U_Drive/U_Drive_Y1 (R7_U_Drive_Y1.2), U_Drive/U_Drive_Y2 (R7_U_Drive_Y2.2), U_Drive/U_Drive_Y3 (R7_U_Drive_Y3.2), U_Drive/U_Drive_Y4 (R7_U_Drive_Y4.2), U_Drive/U_Drive_Y5 (R7_U_Drive_Y5.2), U_Drive/U_Drive_Y6 (R7_U_Drive_Y6.2), U_Drive/U_Drive_Y7 (R7_U_Drive_Y7.2), U_Drive/U_Drive_Y8 (R7_U_Drive_Y8.2), U_Drive/U_Drive_Y9 (R7_U_Drive_Y9.2), U_Drive/U_Drive_Y10 (R7_U_Drive_Y10.2), 电源 (5 pins), 主控制器 (JP8.1 JP10.4 R16.1 TP2.1), 通信接口 (JP7.1)
+12V: 电源 (E4.1 V1.3), 主控制器 (D3.2 JP4.1)
GND: U_Drive/U_Drive_Y1 (Q3_U_Drive_Y1.E Q4_U_Drive_Y1.S R5_U_Drive_Y1.1), U_Drive/U_Drive_Y2 (Q3_U_Drive_Y2.E Q4_U_Drive_Y2.S R5_U_Drive_Y2.1), U_Drive/U_Drive_Y3 (Q3_U_Drive_Y3.E Q4_U_Drive_Y3.S R5_U_Drive_Y3.1), U_Drive/U_Drive_Y4 (Q3_U_Drive_Y4.E Q4_U_Drive_Y4.S R5_U_Drive_Y4.1), U_Drive/U_Drive_Y5 (Q3_U_Drive_Y5.E Q4_U_Drive_Y5.S R5_U_Drive_Y5.1), U_Drive/U_Drive_Y6 (Q3_U_Drive_Y6.E Q4_U_Drive_Y6.S R5_U_Drive_Y6.1), U_Drive/U_Drive_Y7 (Q3_U_Drive_Y7.E Q4_U_Drive_Y7.S R5_U_Drive_Y7.1), U_Drive/U_Drive_Y8 (Q3_U_Drive_Y8.E Q4_U_Drive_Y8.S R5_U_Drive_Y8.1), U_Drive/U_Drive_Y9 (Q3_U_Drive_Y9.E Q4_U_Drive_Y9.S R5_U_Drive_Y9.1), U_Drive/U_Drive_Y10 (Q3_U_Drive_Y10.E Q4_U_Drive_Y10.S R5_U_Drive_Y10.1), U_Drive/U_Drive_X1 (Q2_U_Drive_X1.E R4_U_Drive_X1.2), U_Drive/U_Drive_X2 (Q2_U_Drive_X2.E R4_U_Drive_X2.2), U_Drive/U_Drive_X3 (Q2_U_Drive_X3.E R4_U_Drive_X3.2), U_Drive/U_Drive_X4 (Q2_U_Drive_X4.E R4_U_Drive_X4.2), U_Drive/U_Drive_X5 (Q2_U_Drive_X5.E R4_U_Drive_X5.2), U_Drive/U_Drive_X6 (Q2_U_Drive_X6.E R4_U_Drive_X6.2), U_Drive/U_Drive_X7 (Q2_U_Drive_X7.E R4_U_Drive_X7.2), U_Drive/U_Drive_X8 (Q2_U_Drive_X8.E R4_U_Drive_X8.2), U_Drive/U_Drive_X9 (Q2_U_Drive_X9.E R4_U_Drive_X9.2), U_Drive/U_Drive_X10 (Q2_U_Drive_X10.E R4_U_Drive_X10.2), U_Drive/U_SIG_IN1 (Q5_U_SIG_IN1.E R11_U_SIG_IN1.1), U_Drive/U_SIG_IN2 (Q5_U_SIG_IN2.E R11_U_SIG_IN2.1), U_Drive/U_SIG_IN3 (Q5_U_SIG_IN3.E R11_U_SIG_IN3.1), U_Drive/U_SIG_IN4 (Q5_U_SIG_IN4.E R11_U_SIG_IN4.1), U_Drive/U_SIG_IN5 (Q5_U_SIG_IN5.E R11_U_SIG_IN5.1), U_Drive/U_SIG_IN6 (Q5_U_SIG_IN6.E R11_U_SIG_IN6.1), U_Drive/U_SIG_IN7 (Q5_U_SIG_IN7.E R11_U_SIG_IN7.1), U_Drive/U_SIG_IN8 (Q5_U_SIG_IN8.E R11_U_SIG_IN8.1), U_Drive/U_SIG_IN9 (Q5_U_SIG_IN9.E R11_U_SIG_IN9.1), U_Drive/U_SIG_IN10 (Q5_U_SIG_IN10.E R11_U_SIG_IN10.1), 电源 (20 pins), 主控制器 (29 pins), 通信接口 (10 pins)
M_24V: Drive (JP5.11), U_Drive/U_Drive_X1 (Q1_U_Drive_X1.S R1_U_Drive_X1.2), U_Drive/U_Drive_X2 (Q1_U_Drive_X2.S R1_U_Drive_X2.2), U_Drive/U_Drive_X3 (Q1_U_Drive_X3.S R1_U_Drive_X3.2), U_Drive/U_Drive_X4 (Q1_U_Drive_X4.S R1_U_Drive_X4.2), U_Drive/U_Drive_X5 (Q1_U_Drive_X5.S R1_U_Drive_X5.2), U_Drive/U_Drive_X6 (Q1_U_Drive_X6.S R1_U_Drive_X6.2), U_Drive/U_Drive_X7 (Q1_U_Drive_X7.S R1_U_Drive_X7.2), U_Drive/U_Drive_X8 (Q1_U_Drive_X8.S R1_U_Drive_X8.2), U_Drive/U_Drive_X9 (Q1_U_Drive_X9.S R1_U_Drive_X9.2), U_Drive/U_Drive_X10 (Q1_U_Drive_X10.S R1_U_Drive_X10.2), 电源 (D7.2 D9.2)
CTRL_X: U_Drive/U_Drive_X1 (R3_U_Drive_X1.1 R4_U_Drive_X1.1), 主控制器 (U1.57)
CTRL_X: U_Drive/U_Drive_X2 (R3_U_Drive_X2.1 R4_U_Drive_X2.1), 主控制器 (U1.56)
CTRL_X: U_Drive/U_Drive_X3 (R3_U_Drive_X3.1 R4_U_Drive_X3.1), 主控制器 (U1.55)
CTRL_X: U_Drive/U_Drive_X4 (R3_U_Drive_X4.1 R4_U_Drive_X4.1), 主控制器 (U1.54)
CTRL_X: U_Drive/U_Drive_X5 (R3_U_Drive_X5.1 R4_U_Drive_X5.1), 主控制器 (U1.53)
CTRL_X: U_Drive/U_Drive_X6 (R3_U_Drive_X6.1 R4_U_Drive_X6.1), 主控制器 (U1.52)
CTRL_X: U_Drive/U_Drive_X7 (R3_U_Drive_X7.1 R4_U_Drive_X7.1), 主控制器 (U1.51)
CTRL_X: U_Drive/U_Drive_X8 (R3_U_Drive_X8.1 R4_U_Drive_X8.1), 主控制器 (U1.50)
CTRL_X: U_Drive/U_Drive_X9 (R3_U_Drive_X9.1 R4_U_Drive_X9.1), 主控制器 (U1.49)
CTRL_X: U_Drive/U_Drive_X10 (R3_U_Drive_X10.1 R4_U_Drive_X10.1), 主控制器 (U1.48)
CTRL_Y: U_Drive/U_Drive_Y1 (R5_U_Drive_Y1.2 R6_U_Drive_Y1.1), 主控制器 (U1.46)
CTRL_Y: U_Drive/U_Drive_Y2 (R5_U_Drive_Y2.2 R6_U_Drive_Y2.1), 主控制器 (U1.45)
CTRL_Y: U_Drive/U_Drive_Y3 (R5_U_Drive_Y3.2 R6_U_Drive_Y3.1), 主控制器 (U1.44)
CTRL_Y: U_Drive/U_Drive_Y4 (R5_U_Drive_Y4.2 R6_U_Drive_Y4.1), 主控制器 (U1.43)
CTRL_Y: U_Drive/U_Drive_Y5 (R5_U_Drive_Y5.2 R6_U_Drive_Y5.1), 主控制器 (U1.42)
CTRL_Y: U_Drive/U_Drive_Y6 (R5_U_Drive_Y6.2 R6_U_Drive_Y6.1), 主控制器 (U1.37)
CTRL_Y: U_Drive/U_Drive_Y7 (R5_U_Drive_Y7.2 R6_U_Drive_Y7.1), 主控制器 (U1.36)
CTRL_Y: U_Drive/U_Drive_Y8 (R5_U_Drive_Y8.2 R6_U_Drive_Y8.1), 主控制器 (U1.35)
CTRL_Y: U_Drive/U_Drive_Y9 (R5_U_Drive_Y9.2 R6_U_Drive_Y9.1), 主控制器 (U1.34)
CTRL_Y: U_Drive/U_Drive_Y10 (R5_U_Drive_Y10.2 R6_U_Drive_Y10.1), 主控制器 (U1.33)
Drive_X: Drive (JP2.1), U_Drive/U_Drive_X10 (Q1_U_Drive_X10.D)
Drive_X: Drive (JP2.2), U_Drive/U_Drive_X9 (Q1_U_Drive_X9.D)
Drive_X: Drive (JP2.3), U_Drive/U_Drive_X8 (Q1_U_Drive_X8.D)
Drive_X: Drive (JP2.4), U_Drive/U_Drive_X7 (Q1_U_Drive_X7.D)
Drive_X: Drive (JP2.5), U_Drive/U_Drive_X6 (Q1_U_Drive_X6.D)
Drive_X: Drive (JP2.6), U_Drive/U_Drive_X5 (Q1_U_Drive_X5.D)
Drive_X: Drive (JP2.7), U_Drive/U_Drive_X4 (Q1_U_Drive_X4.D)
Drive_X: Drive (JP2.8), U_Drive/U_Drive_X3 (Q1_U_Drive_X3.D)
Drive_X: Drive (JP2.9), U_Drive/U_Drive_X2 (Q1_U_Drive_X2.D)
Drive_X: Drive (JP2.10), U_Drive/U_Drive_X1 (Q1_U_Drive_X1.D)
Drive_Y: Drive (JP3.1), U_Drive/U_Drive_Y10 (Q4_U_Drive_Y10.D)
Drive_Y: Drive (JP3.2), U_Drive/U_Drive_Y9 (Q4_U_Drive_Y9.D)
Drive_Y: Drive (JP3.3), U_Drive/U_Drive_Y8 (Q4_U_Drive_Y8.D)
Drive_Y: Drive (JP3.4), U_Drive/U_Drive_Y7 (Q4_U_Drive_Y7.D)
Drive_Y: Drive (JP3.5), U_Drive/U_Drive_Y6 (Q4_U_Drive_Y6.D)
Drive_Y: Drive (JP3.6), U_Drive/U_Drive_Y5 (Q4_U_Drive_Y5.D)
Drive_Y: Drive (JP3.7), U_Drive/U_Drive_Y4 (Q4_U_Drive_Y4.D)
Drive_Y: Drive (JP3.8), U_Drive/U_Drive_Y3 (Q4_U_Drive_Y3.D)
Drive_Y: Drive (JP3.9), U_Drive/U_Drive_Y2 (Q4_U_Drive_Y2.D)
Drive_Y: Drive (JP3.10), U_Drive/U_Drive_Y1 (Q4_U_Drive_Y1.D)
RS485_DIR: 主控制器 (U1.59), 通信接口 (U3.2 U3.3)
RXD: 主控制器 (U1.12), 通信接口 (JP7.5 U3.1 U4.9)
SIG: U_Drive/U_SIG_IN1 (Q5_U_SIG_IN1.C), 主控制器 (U1.58)
SIG: U_Drive/U_SIG_IN2 (Q5_U_SIG_IN2.C), 主控制器 (U1.62)
SIG: U_Drive/U_SIG_IN3 (Q5_U_SIG_IN3.C), 主控制器 (U1.21)
SIG: U_Drive/U_SIG_IN4 (Q5_U_SIG_IN4.C), 主控制器 (U1.22)
SIG: U_Drive/U_SIG_IN5 (Q5_U_SIG_IN5.C), 主控制器 (U1.23)
SIG: U_Drive/U_SIG_IN6 (Q5_U_SIG_IN6.C), 主控制器 (U1.24)
SIG: U_Drive/U_SIG_IN7 (Q5_U_SIG_IN7.C), 主控制器 (U1.25)
SIG: U_Drive/U_SIG_IN8 (Q5_U_SIG_IN8.C), 主控制器 (U1.26)
SIG: U_Drive/U_SIG_IN9 (Q5_U_SIG_IN9.C), 主控制器 (U1.31)
SIG: U_Drive/U_SIG_IN10 (Q5_U_SIG_IN10.C), 主控制器 (U1.32)
SIG_IN: Drive (JP5.1), U_Drive/U_SIG_IN1 (R10_U_SIG_IN1.2)
SIG_IN: Drive (JP5.2), U_Drive/U_SIG_IN2 (R10_U_SIG_IN2.2)
SIG_IN: Drive (JP5.3), U_Drive/U_SIG_IN3 (R10_U_SIG_IN3.2)
SIG_IN: Drive (JP5.4), U_Drive/U_SIG_IN4 (R10_U_SIG_IN4.2)
SIG_IN: Drive (JP5.5), U_Drive/U_SIG_IN5 (R10_U_SIG_IN5.2)
SIG_IN: Drive (JP5.6), U_Drive/U_SIG_IN6 (R10_U_SIG_IN6.2)
SIG_IN: Drive (JP5.7), U_Drive/U_SIG_IN7 (R10_U_SIG_IN7.2)
SIG_IN: Drive (JP5.8), U_Drive/U_SIG_IN8 (R10_U_SIG_IN8.2)
SIG_IN: Drive (JP5.9), U_Drive/U_SIG_IN9 (R10_U_SIG_IN9.2)
SIG_IN: Drive (JP5.10), U_Drive/U_SIG_IN10 (R10_U_SIG_IN10.2)
TXD: 主控制器 (U1.11), 通信接口 (JP7.6 U3.4 U4.10)